# Altium schematic sheet led3.SchDoc
size A4; DocumentNumber: 3; SheetNumber: 3; SheetTotal: 8
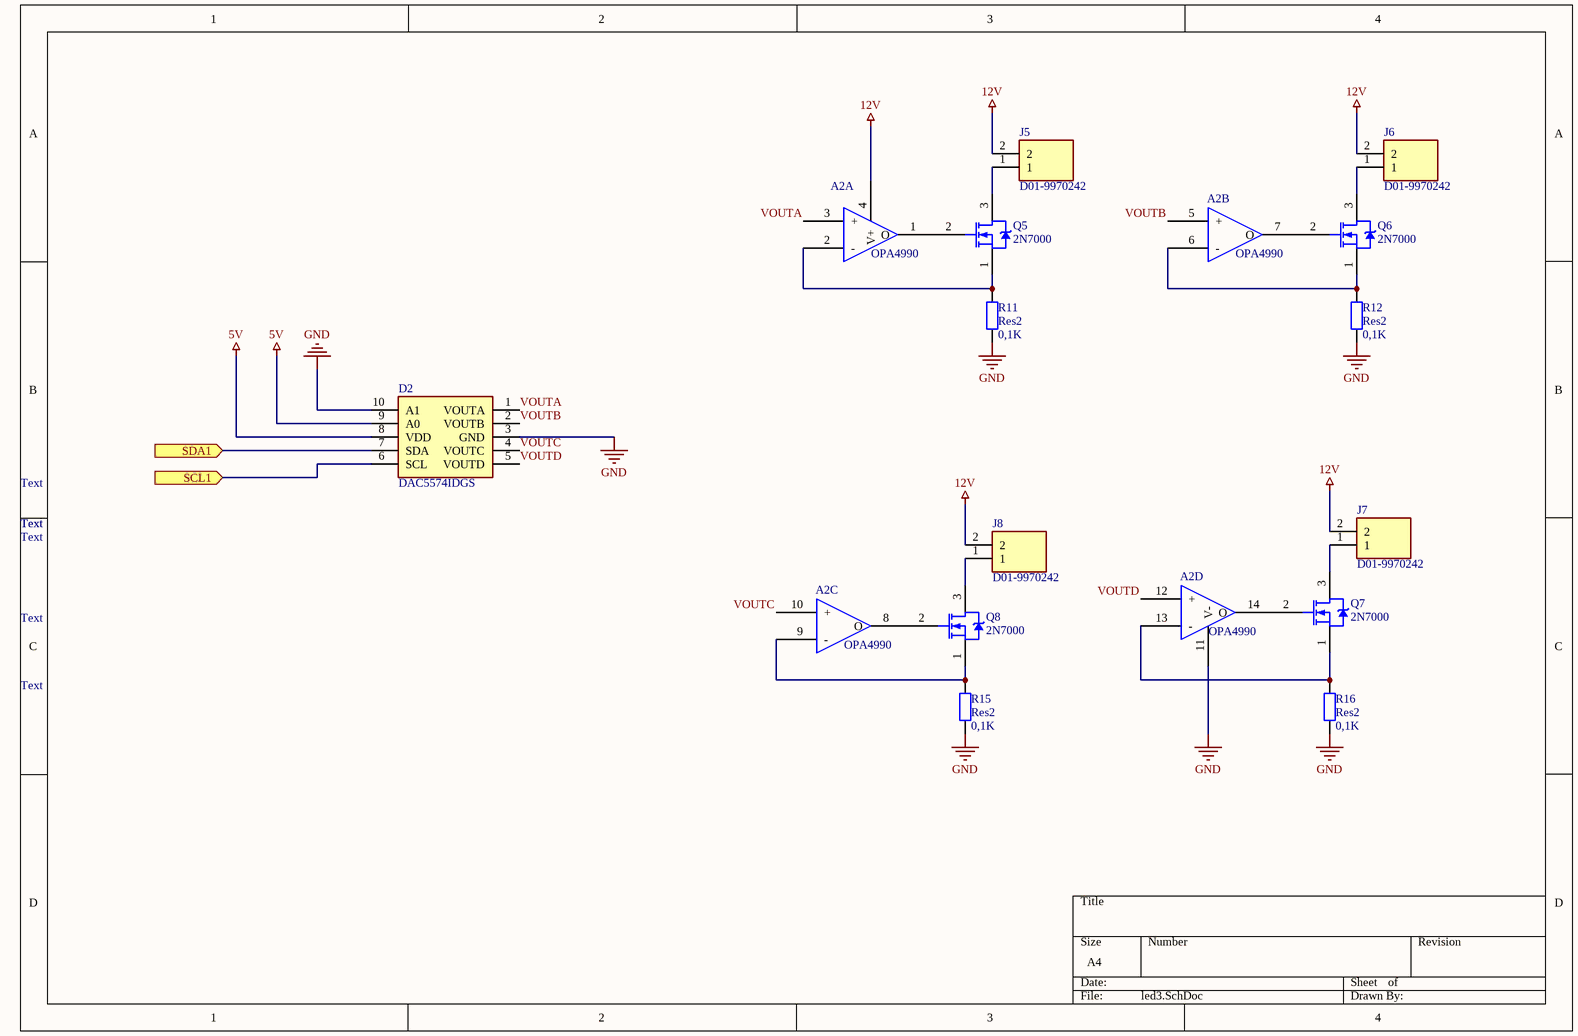
[diagram p0: led3.SchDoc]

## Parts
A2  OPA4990  [SOIC127P600X175-14N]  (parts A,B,C,D of 4)
D2  DAC5574IDGS  [SOP50P490X110-10N]
J5  D01-9970242  [HDR1X2]
J6  D01-9970242  [HDR1X2]
J7  D01-9970242  [HDR1X2]
J8  D01-9970242  [HDR1X2]
Q5  2N7000  [ONSC-TO-92-3-29-11]
Q6  2N7000  [ONSC-TO-92-3-29-11]
Q7  2N7000  [ONSC-TO-92-3-29-11]
Q8  2N7000  [ONSC-TO-92-3-29-11]
R11  Res2  value 0,1K  [C1210]
R12  Res2  value 0,1K  [C1210]
R15  Res2  value 0,1K  [C1210]
R16  Res2  value 0,1K  [C1210]

## Ports
SCL1 (in), SDA1 (in)

## Nets
5V: D2.8(VDD) D2.9(A0)
12V: A2.4(V+) J5.2 J6.2 J7.2 J8.2
GND: A2.11(V-) D2.3(GND) D2.10(A1) R11.1 R12.1 R15.1 R16.1
SCL1: D2.6(SCL) ; port SCL1
SDA1: D2.7(SDA) ; port SDA1
VOUTA: A2.3(+) D2.1(VOUTA)
VOUTB: A2.5(+) D2.2(VOUTB)
VOUTC: A2.10(+) D2.4(VOUTC)
VOUTD: A2.12(+) D2.5(VOUTD)
NetA2_1: A2.1(O) Q5.2(G)
NetA2_2: A2.2(-) Q5.1(S) R11.2
NetA2_6: A2.6(-) Q6.1(S) R12.2
NetA2_7: A2.7(O) Q6.2(G)
NetA2_8: A2.8(O) Q8.2(G)
NetA2_9: A2.9(-) Q8.1(S) R15.2
NetA2_13: A2.13(-) Q7.1(S) R16.2
NetA2_14: A2.14(O) Q7.2(G)
NetJ5_1: J5.1 Q5.3(D)
NetJ6_1: J6.1 Q6.3(D)
NetJ7_1: J7.1 Q7.3(D)
NetJ8_1: J8.1 Q8.3(D)

## Notes on the sheet
- Text

## Library data of the parts
D2 = DAC5574IDGS: Integrated Circuit; Manufacturer_Name: Texas Instruments; Datasheet Link: http://www.ti.com/lit/gpn/dac5574; Height: 1.1mm; Manufacturer_Part_Number: DAC5574IDGS; Mouser Part Number: 595-DAC5574IDGS; Mouser Price/Stock: https://www.mouser.com/Search/Refine.aspx?Keyword=595-DAC5574IDGS; RS Part Number: 6621533P; RS Price/Stock: http://uk.rs-online.com/web/p/products/6621533P
J5-J8 = D01-9970242: Connector; Manufacturer_Name: HARWIN; Datasheet Link: https://componentsearchengine.com/Datasheets/1/D01-9970242.pdf; Height: 4.25mm; Manufacturer_Part_Number: D01-9970242; Mouser Part Number: 855-D01-9970242; Mouser Price/Stock: https://www.mouser.com/Search/Refine.aspx?Keyword=855-D01-9970242
Q5-Q8 = CMP-1058-00936-1: Small Signal MOSFET, 200 mA, 60 V, N-Channel, 3-Pin TO-92, Bulk Box; Manufacturer: On Semiconductor; Ciss Typ (pF): 60; VGS(th) Max (V): 3; Crss Typ (pF): 5; Channel Polarity: N Channel; VGS Max (V): 20; Configuration: Single; PD Max (W): 0.35; Coss Typ (pF): 25; ID Max (A): 0.2; PackageVersion: Rev. AM; ComponentLink3URL: http://www.onsemi.cn/pub_link/Collateral/2N6426-D.PDF; ComponentLink2URL: http://www.onsemi.com/pub_link/Collateral/2N7000-D.PDF; DatasheetVersion: Rev. 8; Mounting Technology: Through Hole; V(BR)DSS Min (V): 60; PartNumber: 2N7000; PackageDescription: 3-Pin Transistor Outline, Body 4.825 x 3.685 mm, Pitch 1.27 mm; ComponentLink2Description: Datasheet; ComponentLink1URL: http://www.onsemi.com/; PackageReference: TO-92-3-29-11_AM_SL; Packing: Bulk Box; ComponentLink1Description: Manufacturer URL; Package Type: TO-92; ComponentLink3Description: Package Specification
R11 R12 R15 R16 = Res2: Resistor; Published: 8-Jun-2000; LatestRevisionDate: 17-Jul-2002; LatestRevisionNote: Re-released for DXP Platform.; PackageReference: AXIAL-0.4; Publisher: Altium Limited; PackageDescription: Axial Device, Thru-Hole; 2 Leads; 0.4 in Pin Spacing